# EAGLE design ir (EAGLE 9.6.2)
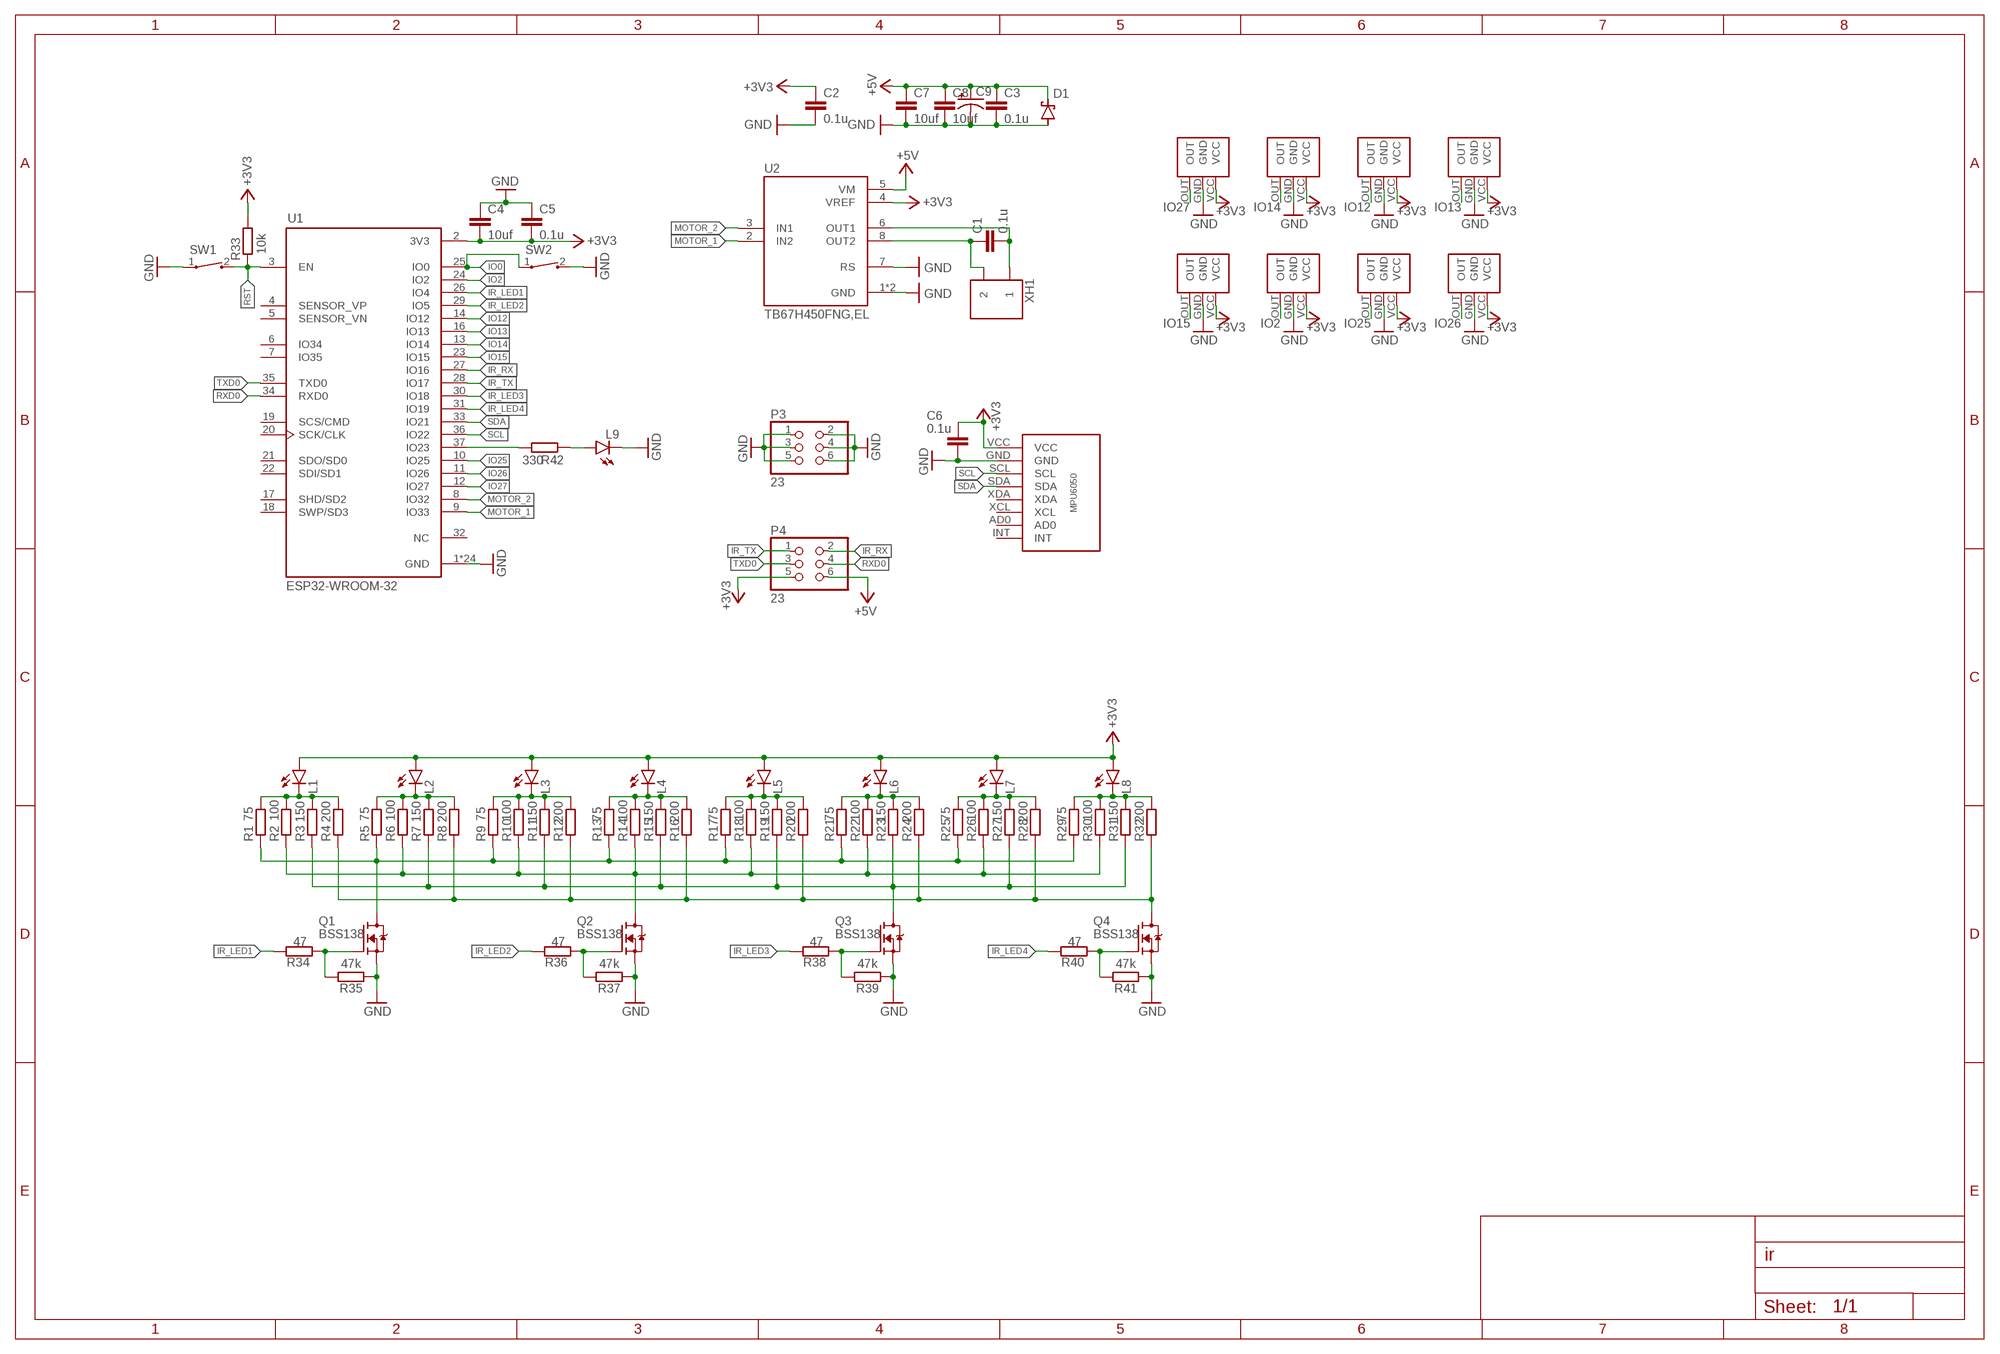
[diagram p0: schematic, sheet 1]

## Parts
C1  0.1u  C-EUC0603  [C0603]
C2  0.1u  C-EUC0603  [C0603]
C3  0.1u  C-EUC0603  [C0603]
C4  10uf  C-EUC0805  [C0805]
C5  0.1u  C-EUC0603  [C0603]
C6  0.1u  C-EUC0603  [C0603]
C7  10uf  C-EUC0805  [C0805]
C8  10uf  C-EUC0805  [C0805]
C9  MH5  [MH5]
D1  SS2040FL  [SOD123FL]
IR1  TSSP4038  [TSSP4038]
IR2  TSSP4038  [TSSP4038]
IR3  TSSP4038  [TSSP4038]
IR4  TSSP4038  [TSSP4038]
IR5  TSSP4038  [TSSP4038]
IR6  TSSP4038  [TSSP4038]
IR7  TSSP4038  [TSSP4038]
IR8  TSSP4038  [TSSP4038]
L1  LED  [LED]
L2  LED  [LED]
L3  LED  [LED]
L4  LED  [LED]
L5  LED  [LED]
L6  LED  [LED]
L7  LED  [LED]
L8  LED  [LED]
L9  SML-E12P8WT86  [LED_SML-LXFM0603SIC-TR]
P3  23  [2*3]
P4  23  [2*3]
Q1  BSS138  [SOT95P240X111-3N]
Q2  BSS138  [SOT95P240X111-3N]
Q3  BSS138  [SOT95P240X111-3N]
Q4  BSS138  [SOT95P240X111-3N]
R1  75  R-EU_R0603  [R0603]
R2  100  R-EU_R0603  [R0603]
R3  150  R-EU_R0603  [R0603]
R4  200  R-EU_R0603  [R0603]
R5  75  R-EU_R0603  [R0603]
R6  100  R-EU_R0603  [R0603]
R7  150  R-EU_R0603  [R0603]
R8  200  R-EU_R0603  [R0603]
R9  75  R-EU_R0603  [R0603]
R10  100  R-EU_R0603  [R0603]
R11  150  R-EU_R0603  [R0603]
R12  200  R-EU_R0603  [R0603]
R13  75  R-EU_R0603  [R0603]
R14  100  R-EU_R0603  [R0603]
R15  150  R-EU_R0603  [R0603]
R16  200  R-EU_R0603  [R0603]
R17  75  R-EU_R0603  [R0603]
R18  100  R-EU_R0603  [R0603]
R19  150  R-EU_R0603  [R0603]
R20  200  R-EU_R0603  [R0603]
R21  75  R-EU_R0603  [R0603]
R22  100  R-EU_R0603  [R0603]
R23  150  R-EU_R0603  [R0603]
R24  200  R-EU_R0603  [R0603]
R25  75  R-EU_R0603  [R0603]
R26  100  R-EU_R0603  [R0603]
R27  150  R-EU_R0603  [R0603]
R28  200  R-EU_R0603  [R0603]
R29  75  R-EU_R0603  [R0603]
R30  100  R-EU_R0603  [R0603]
R31  150  R-EU_R0603  [R0603]
R32  200  R-EU_R0603  [R0603]
R33  10k  R-EU_R0603  [R0603]
R34  47  R-EU_R0603  [R0603]
R35  47k  R-EU_R0603  [R0603]
R36  47  R-EU_R0603  [R0603]
R37  47k  R-EU_R0603  [R0603]
R38  47  R-EU_R0603  [R0603]
R39  47k  R-EU_R0603  [R0603]
R40  47  R-EU_R0603  [R0603]
R41  47k  R-EU_R0603  [R0603]
R42  330  R-EU_R0603  [R0603]
SW1  TATE  [TATE]
SW2  TATE  [TATE]
U1  ESP32-WROOM-32  [MODULE_ESP32-WROOM-32]
U2  TB67H450FNG,EL  [SOIC127P599X175-9N]
U$1  MPU6050  [MPU6050]
XH1  S2B  [S2B]

## Nets
+3V3: C2.1 C4.2 C5.2 C6.1 IR1.VCC IR2.VCC IR3.VCC IR4.VCC IR5.VCC IR6.VCC IR7.VCC IR8.VCC L1.+ L2.+ L3.+ L4.+ L5.+ L6.+ L7.+ L8.+ P4.5 R33.2 U1.2(3V3) U2.4(VREF) U$1.VCC
+5V: C3.1 C7.1 C8.1 C9.+ D1.C P4.6 U2.5(VM)
GND: C2.2 C3.2 C4.1 C5.1 C6.2 C7.2 C8.2 C9.- D1.A IR1.GND IR2.GND IR3.GND IR4.GND IR5.GND IR6.GND IR7.GND IR8.GND L9.C P3.1 P3.2 P3.3 P3.4 P3.5 P3.6 Q1.2(S) Q2.2(S) Q3.2(S) Q4.2(S) R35.2 R37.2 R39.2 R41.2 SW1.1 SW2.2 U1.1(GND) U1.15(GND) U1.38(GND) U1.39_1(GND) U1.39_2(GND) U1.39_3(GND) U1.39_4(GND) U1.39_5(GND) U1.39_6(GND) U1.39_7(GND) U1.39_8(GND) U1.39_9(GND) U1.39_10(GND) U1.39_11(GND) U1.39_12(GND) U1.39_13(GND) U1.39_14(GND) U1.39_15(GND) U1.39_16(GND) U1.39_17(GND) U1.39_18(GND) U1.39_19(GND) U1.39_20(GND) U1.39_21(GND) U2.1(GND) U2.7(RS) U2.9(GND) U$1.GND
IO0: SW2.1 U1.25(IO0)
IO2: IR6.OUT U1.24(IO2)
IO12: IR3.OUT U1.14(IO12)
IO13: IR4.OUT U1.16(IO13)
IO14: IR2.OUT U1.13(IO14)
IO15: IR5.OUT U1.23(IO15)
IO25: IR7.OUT U1.10(IO25)
IO26: IR8.OUT U1.11(IO26)
IO27: IR1.OUT U1.12(IO27)
IR_LED1: R34.2 U1.26(IO4)
IR_LED2: R36.2 U1.29(IO5)
IR_LED3: R38.2 U1.30(IO18)
IR_LED4: R40.2 U1.31(IO19)
IR_RX: P4.2 U1.27(IO16)
IR_TX: P4.1 U1.28(IO17)
MOTOR_1: U1.9(IO33) U2.2(IN2)
MOTOR_2: U1.8(IO32) U2.3(IN1)
N$1: C1.2 U2.6(OUT1) XH1.1
N$2: C1.1 U2.8(OUT2) XH1.2
N$3: L1.- R1.2 R2.2 R3.2 R4.2
N$4: L2.- R5.2 R6.2 R7.2 R8.2
N$5: L3.- R9.2 R10.2 R11.2 R12.2
N$6: L4.- R13.2 R14.2 R15.2 R16.2
N$7: L5.- R17.2 R18.2 R19.2 R20.2
N$8: L6.- R21.2 R22.2 R23.2 R24.2
N$9: L7.- R25.2 R26.2 R27.2 R28.2
N$10: L8.- R29.2 R30.2 R31.2 R32.2
N$12: Q1.3(D) R1.1 R5.1 R9.1 R13.1 R17.1 R21.1 R25.1 R29.1
N$13: Q2.3(D) R2.1 R6.1 R10.1 R14.1 R18.1 R22.1 R26.1 R30.1
N$14: Q3.3(D) R3.1 R7.1 R11.1 R15.1 R19.1 R23.1 R27.1 R31.1
N$15: Q4.3(D) R4.1 R8.1 R12.1 R16.1 R20.1 R24.1 R28.1 R32.1
N$16: Q1.1(G) R34.1 R35.1
N$17: Q2.1(G) R36.1 R37.1
N$18: Q3.1(G) R38.1 R39.1
N$19: Q4.1(G) R40.1 R41.1
N$20: L9.A R42.1
N$21: R42.2 U1.37(IO23)
RST: R33.1 SW1.2 U1.3(EN)
RXD0: P4.4 U1.34(RXD0)
SCL: U1.36(IO22) U$1.SCL
SDA: U1.33(IO21) U$1.SDA
TXD0: P4.3 U1.35(TXD0)
Unconnected: U1.4(SENSOR_VP) U1.5(SENSOR_VN) U1.6(IO34) U1.7(IO35) U1.17(SHD/SD2) U1.18(SWP/SD3) U1.19(SCS/CMD) U1.20(SCK/CLK) U1.21(SDO/SD0) U1.22(SDI/SD1) U1.32(NC) U$1.AD0 U$1.INT U$1.XCL U$1.XDA

## Library data of the parts
C1-C8 = rcl:C-EU: CAPACITOR, European symbol; SPICEPREFIX: C
C9 = capacitor:MH5
D1 = diode:SS2040FL
IR1-IR8 = IR:TSSP4038
L1-L8 = IR:LED
L9 = LED:SML-E12P8WT86
P3 P4 = pin_socket:2*3
Q1-Q4 = BSS138:BSS138: N-Channel 50V 220mA (Ta) 360mW (Ta) Surface Mount SOT-23-3 Check availability <https://pricing.snapeda.com/parts/BSS138/onsemi/view-part?ref=eda>; AVAILABILITY: In Stock; CHECK_PRICES: https://www.snapeda.com/parts/BSS138/Onsemi/view-part/?ref=eda; DESCRIPTION: N-Channel 50 V 220mA (Ta) 350mW (Ta) Surface Mount SOT-23-3; MF: onsemi; MP: BSS138; PACKAGE: SOT-23-3 ON Semiconductor; PRICE: None; PURCHASE-URL: https://www.snapeda.com/api/url_track_click_mouser/?unipart_id=7326959&manufacturer=onsemi&part_name=BSS138&search_term=bss138; SNAPEDA_LINK: https://www.snapeda.com/parts/BSS138/Onsemi/view-part/?ref=snap
R1-R42 = rcl:R-EU_: RESISTOR, European symbol; SPICEPREFIX: R
SW1 SW2 = switch:TATE
U1 = ESP32-WROOM-32:ESP32-WROOM-32: Check availability <https://pricing.snapeda.com/parts/ESP32-WROOM-32/Espressif%20Systems/view-part?ref=eda>; AVAILABILITY: In Stock; CHECK_PRICES: https://www.snapeda.com/parts/ESP32-WROOM-32/Espressif+Systems/view-part/?ref=eda; DESCRIPTION: Bluetooth, WiFi 802.11b/g/n, Bluetooth v4.2 +EDR, Class 1, 2 and 3 Transceiver Module 2.4GHz ~ 2.5GHz Antenna Not Included, U.FL Surface Mount; MF: Espressif Systems; MP: ESP32-WROOM-32; PACKAGE: None; PRICE: None; SNAPEDA_LINK: https://www.snapeda.com/parts/ESP32-WROOM-32/Espressif+Systems/view-part/?ref=snap
U2 = TB67H450FNG_EL:TB67H450FNG,EL: Check availability <https://pricing.snapeda.com/parts/TB67H450FNG%2CEL/Toshiba%20Semiconductor%20and%20Storage/view-part?ref=eda>; AVAILABILITY: In Stock; DESCRIPTION: - Motor Driver - - 8-HSOP; MF: Toshiba Semiconductor and Storage; MP: TB67H450FNG,EL; PACKAGE: SOIC-8 Toshiba Semiconductor and Storage; PRICE: None; PURCHASE-URL: https://pricing.snapeda.com/search/part/TB67H450FNG,EL/?ref=eda
U$1 = MPU6050:MPU6050
XH1 = XH:S2B

## Board
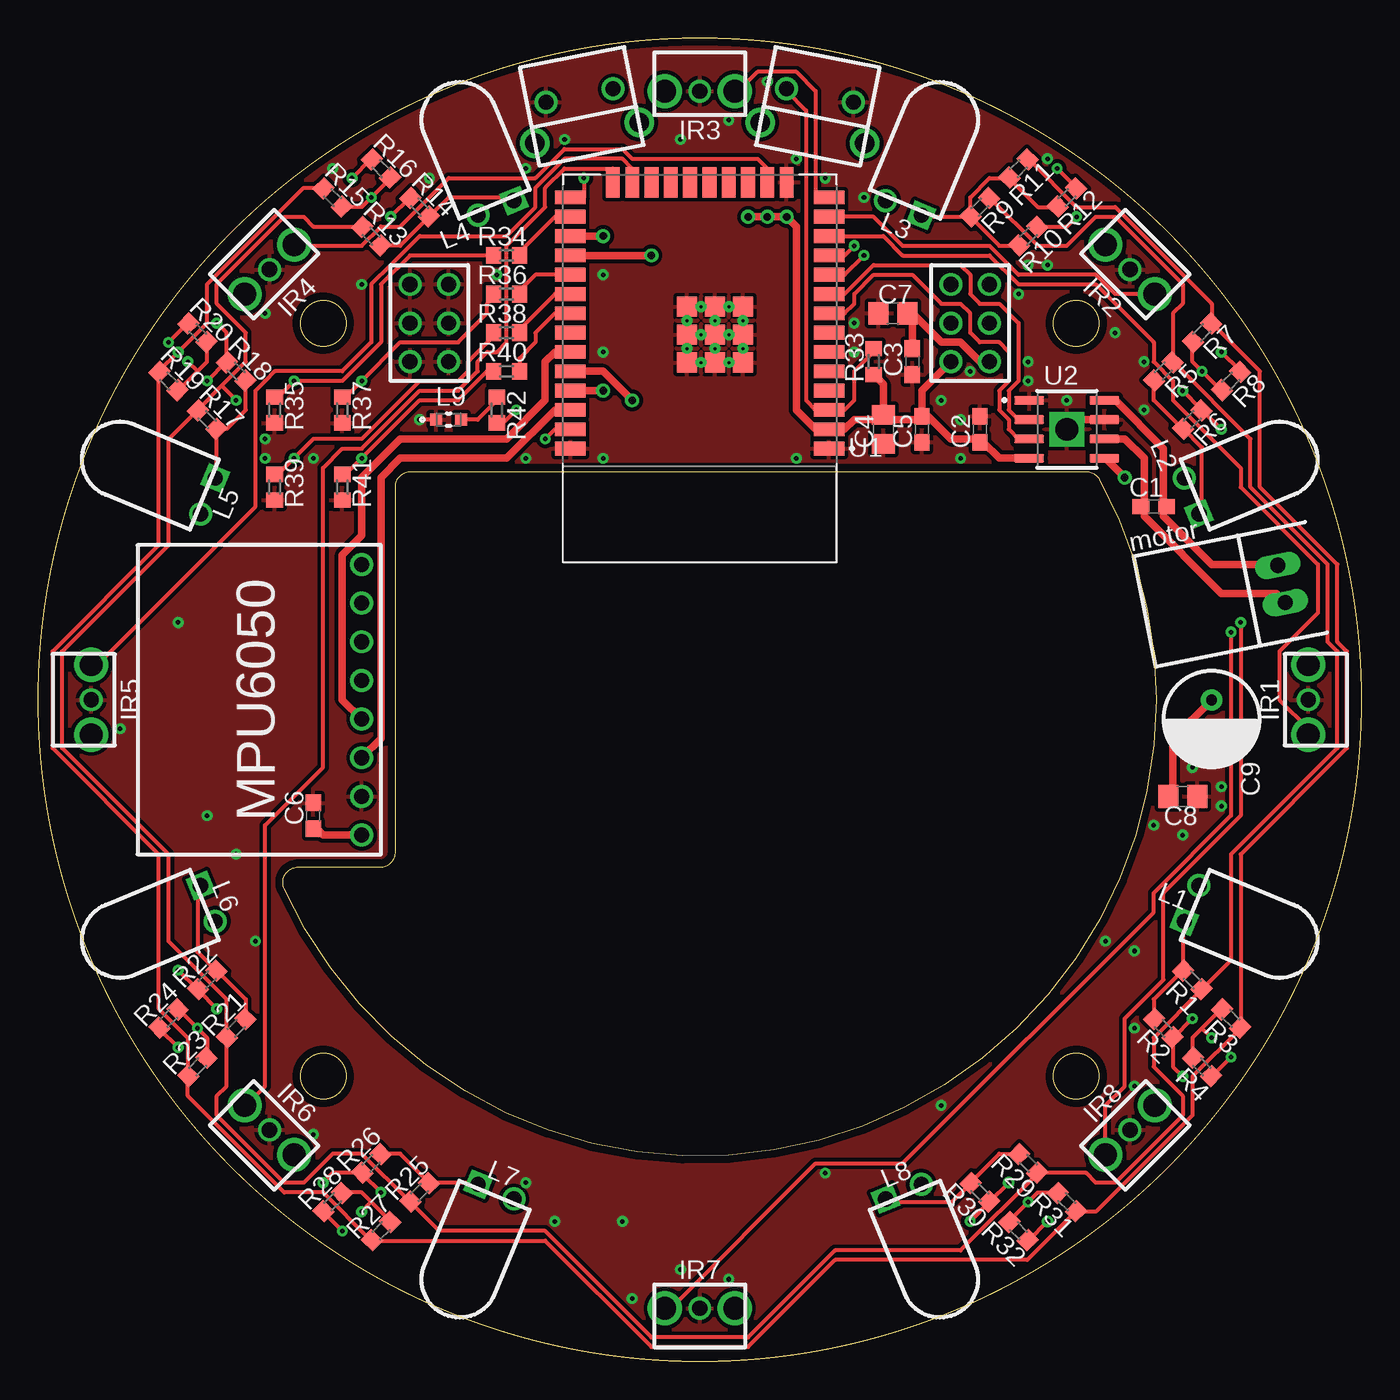
[diagram p1: board, top side]
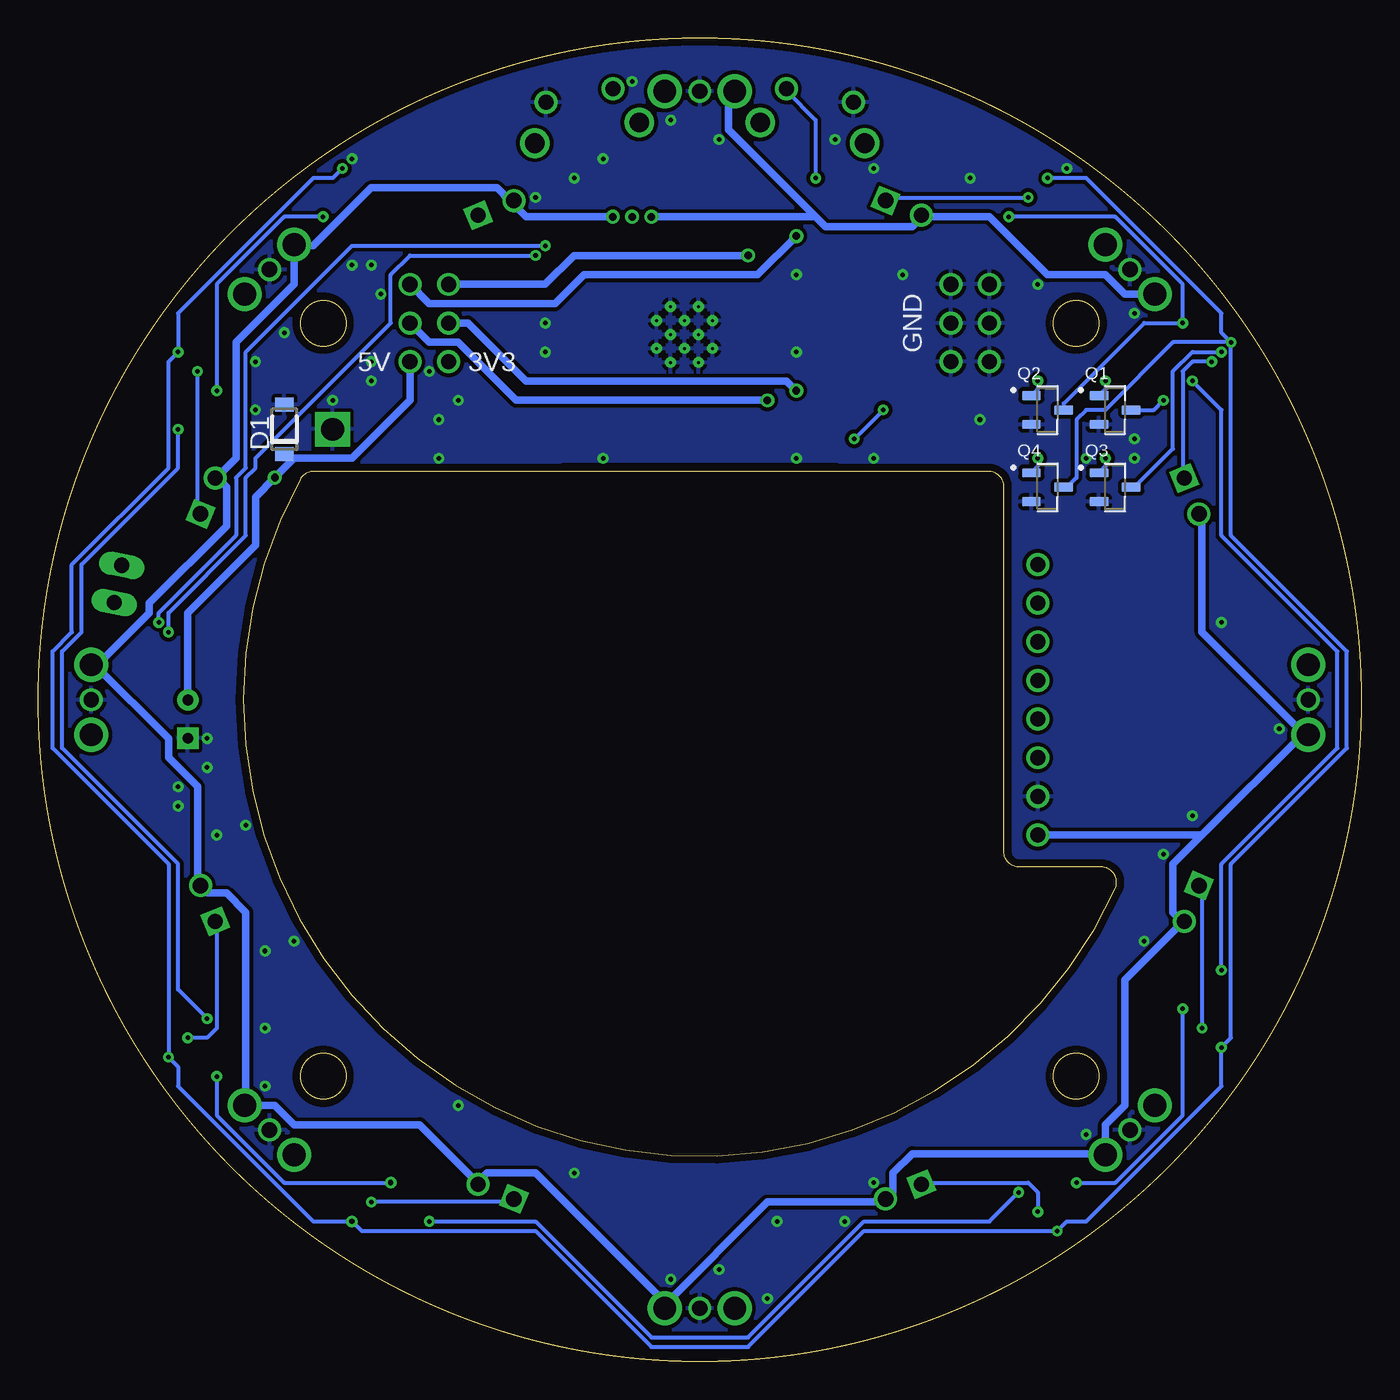
[diagram p2: board, bottom side, seen from below]

Size 87 x 87 mm. Coordinates in mm from the lower left corner, seen from the top.
Outline: 22.5,32.5 arc90 23.5,33.5 23.5,57.5 arc-90 24.5,58.5 68.9,58.5 arc-61 69.77,57.98 arc-184 16.19,31.09 arc-114 17.1,32.5 22.5,32.5
Outline: circle at 68.25,68.25 radius 1.5
Outline: circle at 18.75,18.75 radius 1.5
Outline: circle at 68.25,18.75 radius 1.5
Outline: circle at 18.75,68.25 radius 1.5
Outline: circle at 43.5,43.5 radius 43.5
Copper layers (1*16): Top 0.035mm / dielectric 1.5mm / Bottom 0.035mm
Design rules "default *": minimum track width 6mil, minimum drill 0.3mm, track to track 6mil, track to pad 6mil, pad to pad 6mil, via to via 6mil, smd to smd 6mil, copper to edge 20mil, drill to drill 6mil, minimum pad ring 10mil, minimum via ring 8mil, stop-mask expansion 4mil, vias tented up to drill 0mil, thermal gap 10mil

### Footprints (pad centres in the part's own frame; a part is rotated, then mirrored left to right if it is on the bottom)
C0603 = smd 1.1 x 1: 1 -0.85,0; 2 0.85,0
C0805 = smd 1.3 x 1.5: 1 -0.95,0; 2 0.95,0
MH5 = drill 0.7 pad 1.4: + 1.25,0 | drill 0.7 pad 1.4 square: - -1.25,0
SOD123FL = smd 0.91 x 1.22: A 1.625,0; C -1.625,0
TSSP4038 = drill 1: GND 0,0 | drill 1.5: OUT 2.3,0; VCC -2.3,0
LED = drill 1: + -1.27,0 | drill 1 square: - 1.27,0
LED_SML-LXFM0603SIC-TR = smd 0.8 x 0.8: A 0.825,0; C -0.825,0
2*3 = drill 1: 1 -1.27,2.54; 2 1.27,2.54; 3 -1.27,0; 4 1.27,0; 5 -1.27,-2.54; 6 1.27,-2.54
SOT95P240X111-3N = smd 1.23 x 0.6: 1 -1.06,0.95; 2 -1.06,-0.95; 3 1.06,0
R0603 = smd 1 x 1.1: 1 -0.85,0; 2 0.85,0
TATE = drill 1: 1 -2.25,0; 2 2.25,0 | drill 1.3: NC -3.5,2.5; NC2 3.5,2.5
MODULE_ESP32-WROOM-32 = smd 2 x 0.9: 1 -8.5,5.08; 2 -8.5,3.81; 3 -8.5,2.54; 4 -8.5,1.27; 5 -8.5,0; 6 -8.5,-1.27; 7 -8.5,-2.54; 8 -8.5,-3.81; 9 -8.5,-5.08; 10 -8.5,-6.35; 11 -8.5,-7.62; 12 -8.5,-8.89; 13 -8.5,-10.16; 14 -8.5,-11.43; 25 8.5,-11.43; 26 8.5,-10.16; 27 8.5,-8.89; 28 8.5,-7.62; 29 8.5,-6.35; 30 8.5,-5.08; 31 8.5,-3.81; 32 8.5,-2.54; 33 8.5,-1.27; 34 8.5,0; 35 8.5,1.27; 36 8.5,2.54; 37 8.5,3.81; 38 8.5,5.08 | smd 0.9 x 2: 15 -5.715,-12.43; 16 -4.445,-12.43; 17 -3.175,-12.43; 18 -1.905,-12.43; 19 -0.635,-12.43; 20 0.635,-12.43; 21 1.905,-12.43; 22 3.175,-12.43; 23 4.445,-12.43; 24 5.715,-12.43 | smd 1.33 x 1.33: 39_1 -2.835,-0.585; 39_2 -1,-0.585; 39_3 0.835,-0.585; 39_4 -2.835,-2.42; 39_5 -1,-2.42; 39_6 0.835,-2.42; 39_7 -2.835,-4.255; 39_8 -1,-4.255; 39_9 0.835,-4.255 | drill 0.2 pad 0.3: 39_10 -1.917,-0.585; 39_11 -0.083,-0.585; 39_12 -2.835,-1.502; 39_13 -1,-1.502; 39_14 0.835,-1.502; 39_15 -1.917,-2.42; 39_16 -0.083,-2.42; 39_17 -2.835,-3.337; 39_18 -1,-3.337; 39_19 0.835,-3.337; 39_20 -1.917,-4.255; 39_21 -0.083,-4.255
SOIC127P599X175-9N = smd 1.97 x 0.58: 1 -2.47,1.905; 2 -2.47,0.635; 3 -2.47,-0.635; 4 -2.47,-1.905; 5 2.47,-1.905; 6 2.47,-0.635; 7 2.47,0.635; 8 2.47,1.905 | drill 1.5 pad 2.285 square: 9 0,0
MPU6050 = drill 1: AD0 0,-6.35; GND 0,6.35; INT 0,-8.89; SCL 0,3.81; SDA 0,1.27; VCC 0,8.89; XCL 0,-3.81; XDA 0,-1.27
S2B = drill 1 long: 1 0,1.25; 2 0,-1.25

### Placement (x,y rotation side)
C1  73.34,56.2 180 top
C2  61.91,61.28 90 top
C3  57.47,65.72 270 top
C4  55.56,61.28 90 top
C5  58.11,61.28 90 top
C6  18.1,35.88 90 top
C7  56.2,68.9 180 top
C8  75.25,37.15 0 top
C9  77.16,42.23 90 top
D1  70.81,61.28 90 bottom
IR1  83.5,43.5 270 top
IR2  71.78,71.78 315 top
IR3  43.5,83.5 0 top
IR4  15.22,71.78 45 top
IR5  3.5,43.5 90 top
IR6  15.22,15.22 135 top
IR7  43.5,3.5 180 top
IR8  71.78,15.22 225 top
L1  75.84,30.11 247.5 top
L2  75.84,56.89 292.5 top
L3  56.89,75.84 337.5 top
L4  30.11,75.84 22.5 top
L5  11.16,56.89 67.5 top
L6  11.16,30.11 112.5 top
L7  30.11,11.16 157.5 top
L8  56.89,11.16 202.5 top
L9  26.99,61.91 0 top
P3  25.72,68.27 0 top
P4  61.28,68.27 0 top
Q1  16.2,62.55 0 bottom
Q2  20.64,62.55 0 bottom
Q3  16.2,57.47 0 bottom
Q4  20.64,57.47 0 bottom
R1  75.88,25.09 135 top
R2  73.98,21.91 135 top
R3  78.42,22.55 135 top
R4  76.52,19.37 135 top
R5  73.98,65.09 225 top
R6  75.88,61.91 225 top
R7  76.52,67.63 225 top
R8  78.42,64.45 225 top
R9  61.91,75.88 225 top
R10  65.09,73.98 225 top
R11  64.45,78.42 225 top
R12  67.63,76.52 225 top
R13  21.91,73.98 315 top
R14  25.09,75.88 315 top
R15  19.37,76.52 315 top
R16  22.55,78.42 315 top
R17  11.12,61.91 315 top
R18  13.02,65.09 315 top
R19  8.58,64.45 315 top
R20  10.48,67.63 315 top
R21  13.02,21.91 45 top
R22  11.12,25.09 45 top
R23  10.48,19.37 45 top
R24  8.58,22.55 45 top
R25  25.09,11.12 45 top
R26  21.91,13.02 45 top
R27  22.55,8.58 45 top
R28  19.37,10.48 45 top
R29  65.09,13.02 135 top
R30  61.91,11.12 135 top
R31  67.63,10.48 135 top
R32  64.45,8.58 135 top
R33  54.93,65.72 270 top
R34  30.8,72.71 0 top
R35  15.56,62.55 270 top
R36  30.8,70.17 0 top
R37  20,62.55 270 top
R38  30.8,67.63 0 top
R39  15.56,57.47 270 top
R40  30.8,65.09 0 top
R41  20,57.47 270 top
R42  30.16,62.55 270 top
SW1  51.4,83.22 168.8 top
SW2  35.6,83.22 191.3 top
U1  43.5,65.09 180 top
U2  67.63,61.28 0 top
U$1  21.27,43.5 180 top
XH1  81.75,51.11 191.3 top

### Tracks (layer width: path | path; a pad name or v marks a point on that pad's centre or on a via)
+3V3  (via drill 0.5)
  Top 0.5: C6.1 18.32,35.03 18.73,34.61 U$1.VCC | C4.2 55.25,61.91 53.66,61.91 53.02,61.28 U1.2 51.12,61.28 49.85,62.55 49.85,74.61 v49.22,75.25 v47.95,75.25 v46.67,75.25 | C4.2 55.88,61.91 57.89,61.91 C5.2 | C5.2 58.52,62.13 60.01,60.64 61.7,60.64 C2.1 62.13,60.43 63.19,59.38 U2.4 | R33.2 55.56,64.24 C4.2 | P4.5 58.11,63.82 C5.2
  Bottom 0.5: 10.48,34.61 12.39,32.7 12.39,29.53 11.79,28.93 L6.+ 11.71,28.93 15.56,25.09 15.56,16.83 16.83,15.56 IR6.VCC 16.91,13.66 29.53,13.66 30.8,12.39 30.8,11.16 L7.+ 31.48,10.48 39.05,10.48 45.8,3.73 IR7.VCC 45.8,3.89 54.3,12.39 57.47,12.39 58.07,11.79 L8.+ 58.07,11.71 61.91,15.56 70.17,15.56 71.44,16.83 IR8.VCC 73.34,16.91 73.34,29.53 74.61,30.8 75.84,30.8 L1.+ 76.52,31.48 76.52,37.78 78.42,39.69 78.42,40.96 83.27,45.8 IR1.VCC 83.11,45.8 79.69,49.22 79.69,49.85 74.61,54.93 74.61,57.47 75.21,58.07 L2.+ 75.29,58.07 73.98,59.38 73.98,67 70.17,70.81 IR2.VCC 70.09,73.34 68.9,73.34 65.09,77.16 56.84,77.16 56,76.32 L3.+ 55.72,76.04 54.93,75.25 v49.22,75.25 | 10.48,34.61 3.89,41.2 IR5.VCC 3.73,41.2 10.48,47.95 10.48,55.52 L5.+ | IR4.VCC 15.56,70.17 16.83,71.44 20.64,71.44 21.91,72.71 24.45,75.25 28.83,75.25 L4.+ 28.93,75.21 29.53,74.61 35.24,74.61 35.88,75.25 | IR3.VCC 41.59,83.1 41.59,80.97 35.88,75.25 | v46.67,75.25 35.88,75.25 | U$1.VCC 10.48,34.61
+5V  (via drill 0.5)
  Top 0.5: U2.5 70.17,59.38 v71.44,58.11 | P4.6 61.91,65.72 60.64,67 59.38,67 57.47,68.9 C7.1 57.47,68.58 C3.1 | C8.1 74.61,37.47 74.61,40.94 C9.+
  Bottom 0.5: 70.17,59.38 v71.44,58.11 72.71,56.84 72.71,53.66 77.16,49.22 C9.+ | 70.17,59.38 66.36,59.38 62.55,63.19 P4.6 | D1.C 70.53,59.38 70.17,59.38
GND  (via drill 0.3)
  Top 0.25: L9.C v25.09,61.91
  Top 0.5: U2.7 68.27,61.91 U2.9
  other vias: 53.66,66.36 59.38,63.19 60.64,61.91 61.28,65.09 64.45,70.17 66.36,79.06 51.76,77.79 54.3,76.52 49.85,79.06 47.95,84.14 32.07,78.42 25.72,77.79 19.37,78.42 5.4,41.59 70.81,67.63 45.41,5.4 18.1,14.93 67.63,63.19 65.09,64.45 60.64,59.38 32.07,59.38 37.15,59.38 30.16,71.44 14.93,59.38 18.1,59.38 14.29,27.62 13.02,33.34 11.12,35.88 72.71,62.55 51.76,12.39 39.05,4.13 65.09,72.08 66.36,72.08 77.79,37.78 77.79,36.52 70.17,27.62 72.08,18.1 72.08,21.91 59.38,16.83 42.23,6.03 33.98,9.21 38.42,9.21 32.07,11.75 9.21,48.58 14.93,68.9 53.66,68.27 42.23,80.33 72.71,65.72 65.09,65.72 37.15,71.44 37.15,66.36 49.85,59.38 14.93,60.64 21.27,70.81 34.61,80.33 45.41,81.6 73.34,35.24 75.88,39.05 75.88,40.96 75.25,34.61 72.08,26.99
  pour Bottom (isolate 0.25): -2.22,87.95 89.22,87.95 89.22,-6.03 -2.22,-6.03
  pour Top (isolate 0.25): -2.22,89.22 91.76,89.22 91.76,-8.57 -2.22,-8.57
IO0  (via drill 0.3)
  Top 0.25: U1.25 35.88,76.52 v35.88,77.79
  Bottom 0.25: SW2.1 37.8,83.53 35.88,81.6 v35.88,77.79
IO2
  Top 0.25: IR6.OUT 13.67,16.84 14.93,18.1 14.93,35.24 18.73,39.05 18.73,58.74 20,60.01 21.27,60.01 25.09,63.82 27.62,63.82 28.89,65.09 28.89,65.72 29.53,66.36 30.16,66.36 30.8,67 30.8,73.34 33.34,75.88 33.34,77.16 34.61,78.42 37.78,78.42 U1.24
IO12
  Top 0.25: U1.14 51.12,76.52 51.12,83.5 49.85,84.78 47.31,84.78 46.03,83.5 IR3.OUT
IO13
  Top 0.25: IR4.OUT 16.91,73.34 21.27,73.34 22.55,74.61 23.82,74.61 26.99,77.79 32.7,77.79 34.61,79.69 38.42,79.69 39.05,79.06 47.31,79.06 47.95,78.42 U1.16
IO14
  Top 0.25: IR2.OUT 70.81,70.17 69.53,71.44 64.45,71.44 62.55,73.34 56.84,73.34 54.93,75.25 U1.13
IO15
  Top 0.25: IR5.OUT 3.89,45.8 14.29,56.2 14.29,63.82 14.93,64.45 15.56,65.09 20,65.09 21.91,67 21.91,70.81 23.18,72.08 25.09,73.98 30.8,73.98 32.7,75.88 32.7,77.16 34.61,79.06 38.42,79.06 39.05,78.42 U1.23
IO25  (via drill 0.3)
  Top 0.25: U1.10 53.02,71.44 v54.3,72.71 | IR7.OUT 41.6,3.5 51.12,13.02 56.84,13.02 73.34,29.53 73.34,30.8 78.42,35.88 v78.42,47.95
  Bottom 0.25: v78.42,47.95 78.42,49.22 73.34,54.3 73.34,58.11 72.71,58.74 72.71,59.38 63.82,68.27 63.82,71.44 62.55,72.71 v54.3,72.71
IO26  (via drill 0.3)
  Top 0.25: v53.66,73.34 53.02,72.71 U1.11 | IR8.OUT 70.17,16.83 71.44,18.1 71.44,22.55 73.98,25.09 73.98,30.8 79.06,35.88 v79.06,48.58
  Bottom 0.25: v53.66,73.34 66.36,73.34 73.34,66.36 73.34,58.74 73.98,58.11 73.98,54.3 79.06,49.22 v79.06,48.58
IO27
  Top 0.25: U1.12 55.56,73.98 56.84,72.71 62.55,72.71 64.45,70.81 69.53,70.81 73.34,67 73.34,65.72 74.61,64.45 74.61,63.19 79.06,58.74 79.06,57.47 84.14,52.39 84.14,49.22 81.6,46.67 81.6,43.5 83.5,41.59 IR1.OUT
IR_LED1
  Top 0.25: U1.26 33.98,75.25 31.65,72.92 R34.2
IR_LED2
  Top 0.25: R36.2 31.65,70.39 32.7,71.44 U1.29
IR_LED3
  Top 0.25: U1.30 33.98,70.17 31.65,67.84 R38.2
IR_LED4
  Top 0.25: U1.31 33.98,68.9 32.7,67.63 32.7,67 31.65,65.94 R40.2
IR_RX  (via drill 0.5)
  Top 0.5: U1.27 v37.15,73.98
  Bottom 0.5: P4.2 61.28,69.53 53.02,69.53 51.12,71.44 39.69,71.44 v37.15,73.98
IR_TX  (via drill 0.5)
  Top 0.5: U1.28 v40.33,72.71
  Bottom 0.5: P4.1 53.66,70.81 51.76,72.71 v40.33,72.71
MOTOR_1
  Top 0.25: U1.9 53.02,70.17 54.93,72.08 60.64,72.08 61.28,71.44 61.28,70.17 61.91,69.53 63.19,69.53 64.45,68.27 64.45,64.45 63.82,63.82 63.82,62.55 64.45,61.91 U2.2
MOTOR_2
  Top 0.25: U2.3 64.45,60.64 63.82,61.28 63.82,61.91 63.19,62.55 63.19,63.82 63.82,64.45 63.82,66.36 63.19,67 61.91,67 61.28,67.63 61.28,68.9 60.64,69.53 59.38,69.53 57.47,71.44 54.93,71.44 53.66,70.17 53.66,69.53 53.02,68.9 U1.8
N$1
  Top 0.5: U2.6 71.44,60.64 72.71,59.38 72.71,55.98 | 72.71,55.98 72.71,55.56 77.79,50.48 81.39,50.48 XH1.1 | C1.2 72.71,55.98
N$2
  Top 0.5: U2.8 70.81,63.19 73.98,60.01 73.98,56.2 | XH1.2 81.45,52.39 77.16,52.39 73.98,55.56 73.98,56.2 | C1.1 73.98,56.2
N$3  (via drill 0.3)
  Top 0.25: L1.- 75.25,28.83 75.25,25.72 R1.2 75.22,25.69 73.34,23.82 73.34,22.55 R2.2 | R3.2 77.76,23.15 76.52,21.91 | 76.52,21.91 75.88,21.27 75.88,20 R4.2 | v77.16,21.27 76.52,21.91
  Bottom 0.25: L1.- 75.25,28.83 75.25,21.91 75.88,21.27 v77.16,21.27
N$4  (via drill 0.3)
  Top 0.25: L2.- 76.52,55.92 76.52,60.08 R6.2 75.22,61.31 73.34,63.19 73.34,64.45 R5.2 | R8.2 77.76,63.85 v76.52,65.09 75.88,65.72 75.88,67 R7.2
  Bottom 0.25: L2.- 76.52,55.92 v76.52,65.09
N$5
  Top 0.25: L3.- 58.17,75.25 61.28,75.25 R9.2 | R12.2 67,75.88 65.72,75.88 63.85,77.76 R11.2 63.82,77.79 62.55,77.79 61.28,76.52 61.28,75.32 R9.2 | R9.2 61.31,75.22 63.19,73.34 64.45,73.34 R10.2
N$6  (via drill 0.3)
  Top 0.25: R13.2 22.55,73.34 23.82,73.34 25.69,75.22 R14.2 25.75,75.28 26.99,76.52 31.08,76.52 L4.- | R16.2 23.15,77.76 v21.91,76.52 21.27,75.88 20,75.88 R15.2
  Bottom 0.25: L4.- 31.08,76.52 v21.91,76.52
N$7  (via drill 0.3)
  Top 0.25: L5.- 11.75,58.17 11.75,61.28 R17.2 12.42,61.31 13.66,62.55 13.66,64.45 R18.2 | R19.2 9.24,63.85 10.48,65.09 | 10.48,65.09 11.12,65.72 11.12,67 R20.2 | v9.84,65.72 10.48,65.09
  Bottom 0.25: v9.84,65.72 11.12,65.72 11.75,65.09 11.75,58.17 L5.-
N$8  (via drill 0.3)
  Top 0.25: L6.- 10.48,31.08 10.48,26.92 R22.2 11.78,25.69 13.66,23.82 13.66,22.55 R21.2 | R24.2 9.24,23.15 v10.48,21.91 11.12,21.27 11.12,20 R23.2
  Bottom 0.25: L6.- 10.48,31.08 v10.48,21.91
N$9  (via drill 0.3)
  Top 0.25: L7.- 28.83,11.75 25.72,11.75 R25.2 25.69,11.78 23.82,13.66 22.55,13.66 R26.2 | R27.2 23.15,9.24 21.91,10.48 | R28.2 20,11.12 21.27,11.12 21.91,10.48 | v21.27,9.84 21.91,10.48
  Bottom 0.25: L7.- 28.83,11.75 21.91,11.75 21.27,11.12 v21.27,9.84
N$10  (via drill 0.3)
  Top 0.25: L8.- 55.92,10.48 60.08,10.48 R30.2 61.31,11.78 63.19,13.66 64.45,13.66 R29.2 | R32.2 63.85,9.24 v65.09,10.48 65.72,11.12 67,11.12 R31.2
  Bottom 0.25: L8.- 55.92,10.48 v65.09,10.48
N$12  (via drill 0.3)
  Top 0.25: R9.1 62.58,76.49 65.72,73.34 67.63,73.34 69.53,75.25 70.81,75.25 75.25,70.81 75.25,69.53 74.61,68.9 74.61,65.72 R5.1 74.65,65.69 79.69,60.64 79.69,57.47 84.78,52.39 84.78,47.31 85.41,46.67 85.41,40.33 78.42,33.34 78.42,26.36 76.55,24.48 R1.1 76.49,24.42 73.34,21.27 73.34,19.37 75.25,17.46 75.25,16.2 70.81,11.75 69.53,11.75 68.9,12.39 65.72,12.39 R29.1 65.69,12.35 60.64,7.3 52.39,7.3 46.67,1.59 40.33,1.59 33.34,8.58 26.36,8.58 24.48,10.45 R25.1 24.42,10.51 21.27,13.66 19.37,13.66 17.46,11.75 16.2,11.75 11.75,16.2 11.75,17.46 12.39,18.1 12.39,21.27 R21.1 12.39,21.34 12.39,23.82 8.58,27.62 8.58,33.34 1.59,40.33 1.59,46.67 8.58,53.66 8.58,60.64 10.45,62.52 R17.1 10.51,62.58 12.07,64.14 | 12.07,64.14 13.66,65.72 13.66,67.63 11.75,69.53 11.75,70.81 16.2,75.25 17.46,75.25 18.1,74.61 21.27,74.61 R13.1 | v13.02,63.19 12.07,64.14
  Bottom 0.25: Q1.3 13.66,62.55 v13.02,63.19
N$13  (via drill 0.3, 0.35)
  Top 0.25: v75.25,63.82 76.49,62.58 R6.1 76.55,62.52 v77.79,61.28 | v75.88,22.55 74.65,21.31 R2.1 74.61,21.27 74.61,19.37 v75.25,18.73 | v63.82,11.75 62.58,10.51 R30.1 62.52,10.45 v61.28,9.21 | v22.55,11.12 21.31,12.35 R26.1 21.27,12.39 19.37,12.39 v18.73,11.75 | v11.75,23.18 10.51,24.42 R22.1 10.45,24.48 v9.21,25.72 | R10.1 65.72,74.61 67.63,74.61 v68.27,75.25 | v11.12,64.45 12.35,65.69 R18.1 12.39,65.72 12.39,67.63 v11.75,68.27 | R14.1 24.42,76.49 v23.18,75.25
  Bottom 0.25: v75.25,63.82 75.25,70.81 70.81,75.25 v68.27,75.25 | v63.82,11.75 70.81,11.75 75.25,16.2 v75.25,18.73 | v75.88,22.55 77.79,24.45 77.79,32.7 85.41,40.33 85.41,46.67 84.14,47.95 84.14,52.39 77.79,58.74 v77.79,61.28 | v18.73,11.75 16.2,11.75 11.75,16.2 v11.75,23.18 | v61.28,9.21 54.3,9.21 46.67,1.59 40.33,1.59 32.7,9.21 24.45,9.21 v22.55,11.12 | v23.18,75.25 16.2,75.25 11.75,70.81 v11.75,68.27 14.29,68.27 19.58,62.98 Q2.3 | v9.21,25.72 9.21,32.7 1.59,40.33 1.59,46.67 9.21,54.3 9.21,62.55 v11.12,64.45
N$14  (via drill 0.3)
  Top 0.25: R11.1 65.12,79.03 68.27,75.88 70.81,75.88 77.16,69.53 77.16,68.27 R7.1 77.19,68.23 80.33,65.09 80.33,57.47 85.41,52.39 85.41,47.31 86.05,46.67 86.05,40.33 79.06,33.34 79.06,21.94 79.03,21.91 | R3.1 79.03,21.91 | 79.03,21.91 79.03,21.88 75.88,18.73 75.88,16.2 69.53,9.84 68.27,9.84 R31.1 65.02,6.67 52.39,6.67 46.67,0.95 40.33,0.95 33.34,7.94 21.98,7.94 R27.1 21.88,7.97 18.73,11.12 16.2,11.12 9.84,17.46 9.84,18.73 R23.1 9.88,21.24 7.94,23.18 7.94,33.34 0.95,40.33 0.95,46.67 7.94,53.66 7.94,65.09 7.97,65.12 | R19.1 7.97,65.12 | R15.1 18.73,77.16 17.46,77.16 11.12,70.81 11.12,68.27 v9.21,66.36 7.97,65.12
  Bottom 0.25: Q3.3 14.93,57.47 12.39,60.01 12.39,65.09 11.12,66.36 v9.21,66.36
N$15  (via drill 0.3, 0.35)
  Top 0.25: R12.1 68.23,77.19 v67,78.42 | R8.1 79.03,65.12 v77.79,66.36 | R4.1 77.19,18.77 v78.42,20 | R32.1 65.12,7.97 v66.36,9.21 | R28.1 18.77,9.81 v20,8.58 | R24.1 7.97,21.88 v9.21,20.64 | R20.1 9.81,68.23 v8.58,67 | R16.1 21.88,79.03 v20.64,77.79
  Bottom 0.25: v67,78.42 67.63,77.79 68.9,77.79 77.79,68.9 v77.79,66.36 78.42,65.72 78.42,58.74 84.78,52.39 84.78,47.95 86.05,46.67 86.05,40.33 78.42,32.7 v78.42,20 77.79,19.37 77.79,18.1 68.9,9.21 v66.36,9.21 65.72,8.58 54.3,8.58 46.67,0.95 40.33,0.95 32.7,8.58 v20,8.58 19.37,9.21 18.1,9.21 9.21,18.1 v9.21,20.64 8.58,21.27 8.58,32.7 0.95,40.33 0.95,46.67 8.58,54.3 v8.58,67 | v8.58,67 9.21,67.63 9.21,68.9 18.1,77.79 v20.64,77.79 | v8.58,67 12.39,67 16.83,62.55 18.1,62.55 18.73,61.91 18.73,58.11 19.37,57.47 Q4.3
N$16  (via drill 0.3)
  Top 0.25: R35.1 15.77,63.4 v16.83,64.45 20,64.45 22.55,67 22.55,70.81 24.45,72.71 R34.1
  Bottom 0.25: v16.83,64.45 16.83,63.92 Q1.1
N$17  (via drill 0.3)
  Top 0.25: R37.1 20.22,63.4 v21.27,64.45 23.82,67 27.62,67 29.53,68.9 29.53,69.53 29.95,69.95 R36.1
  Bottom 0.25: v21.27,64.45 21.27,63.92 Q2.1
N$18  (via drill 0.3)
  Top 0.25: R39.1 15.77,58.32 v16.83,59.38 18.1,60.64 21.27,60.64 25.09,64.45 27.62,64.45 28.26,65.09 28.26,65.72 29.95,67.41 R38.1
  Bottom 0.25: v16.83,59.38 16.83,58.84 Q3.1
N$19  (via drill 0.3)
  Top 0.25: R41.1 20.22,58.32 v21.27,59.38 25.09,63.19 27.62,63.19 29.53,65.09 R40.1
  Bottom 0.25: v21.27,59.38 21.27,58.84 Q4.1
N$20
  Top 0.25: R42.1 30.16,63.19 28.89,61.91 L9.A
N$21  (via drill 0.3)
  Top 0.25: U1.37 33.98,61.28 v33.34,60.64 | v31.44,62.55 30.59,61.7 R42.2
  Bottom 0.25: v33.34,60.64 v31.44,62.55
RST
  Top 0.25: SW1.2 49.19,83.53 50.48,82.23 50.48,63.19 51.12,62.55 U1.3 53.02,62.55 53.66,63.19 53.66,65.09 54.93,66.36 R33.1
RXD0  (via drill 0.5)
  Top 0.5: v39.05,63.19 37.15,65.09 U1.34
  Bottom 0.5: P4.4 61.28,67 59.38,67 55.56,63.19 v39.05,63.19
SCL
  Top 0.5: U$1.SCL 22.55,40.96 22.55,58.11 23.82,59.38 30.8,59.38 33.98,62.55 U1.36
SDA
  Top 0.5: U$1.SDA 20,43.5 20,53.02 21.27,54.3 21.27,58.11 23.82,60.64 30.8,60.64 33.34,63.19 33.34,65.72 33.98,66.36 U1.33
TXD0  (via drill 0.5)
  Top 0.5: v37.15,63.82 U1.35
  Bottom 0.5: P4.3 58.74,68.27 54.93,64.45 37.78,64.45 v37.15,63.82

### Text on the board
tPlace: motor | MPU6050
bPlace: GND | 3V3 | 5V